# Altium schematic sheet audio_ldo.SchDoc
size 420 x 297 mm; Organization: Altium Limited; Address1: L3, 12a Rodborough Rd; Address2: Frenchs Forest; Address3: NSW; Address4: Australia 2086
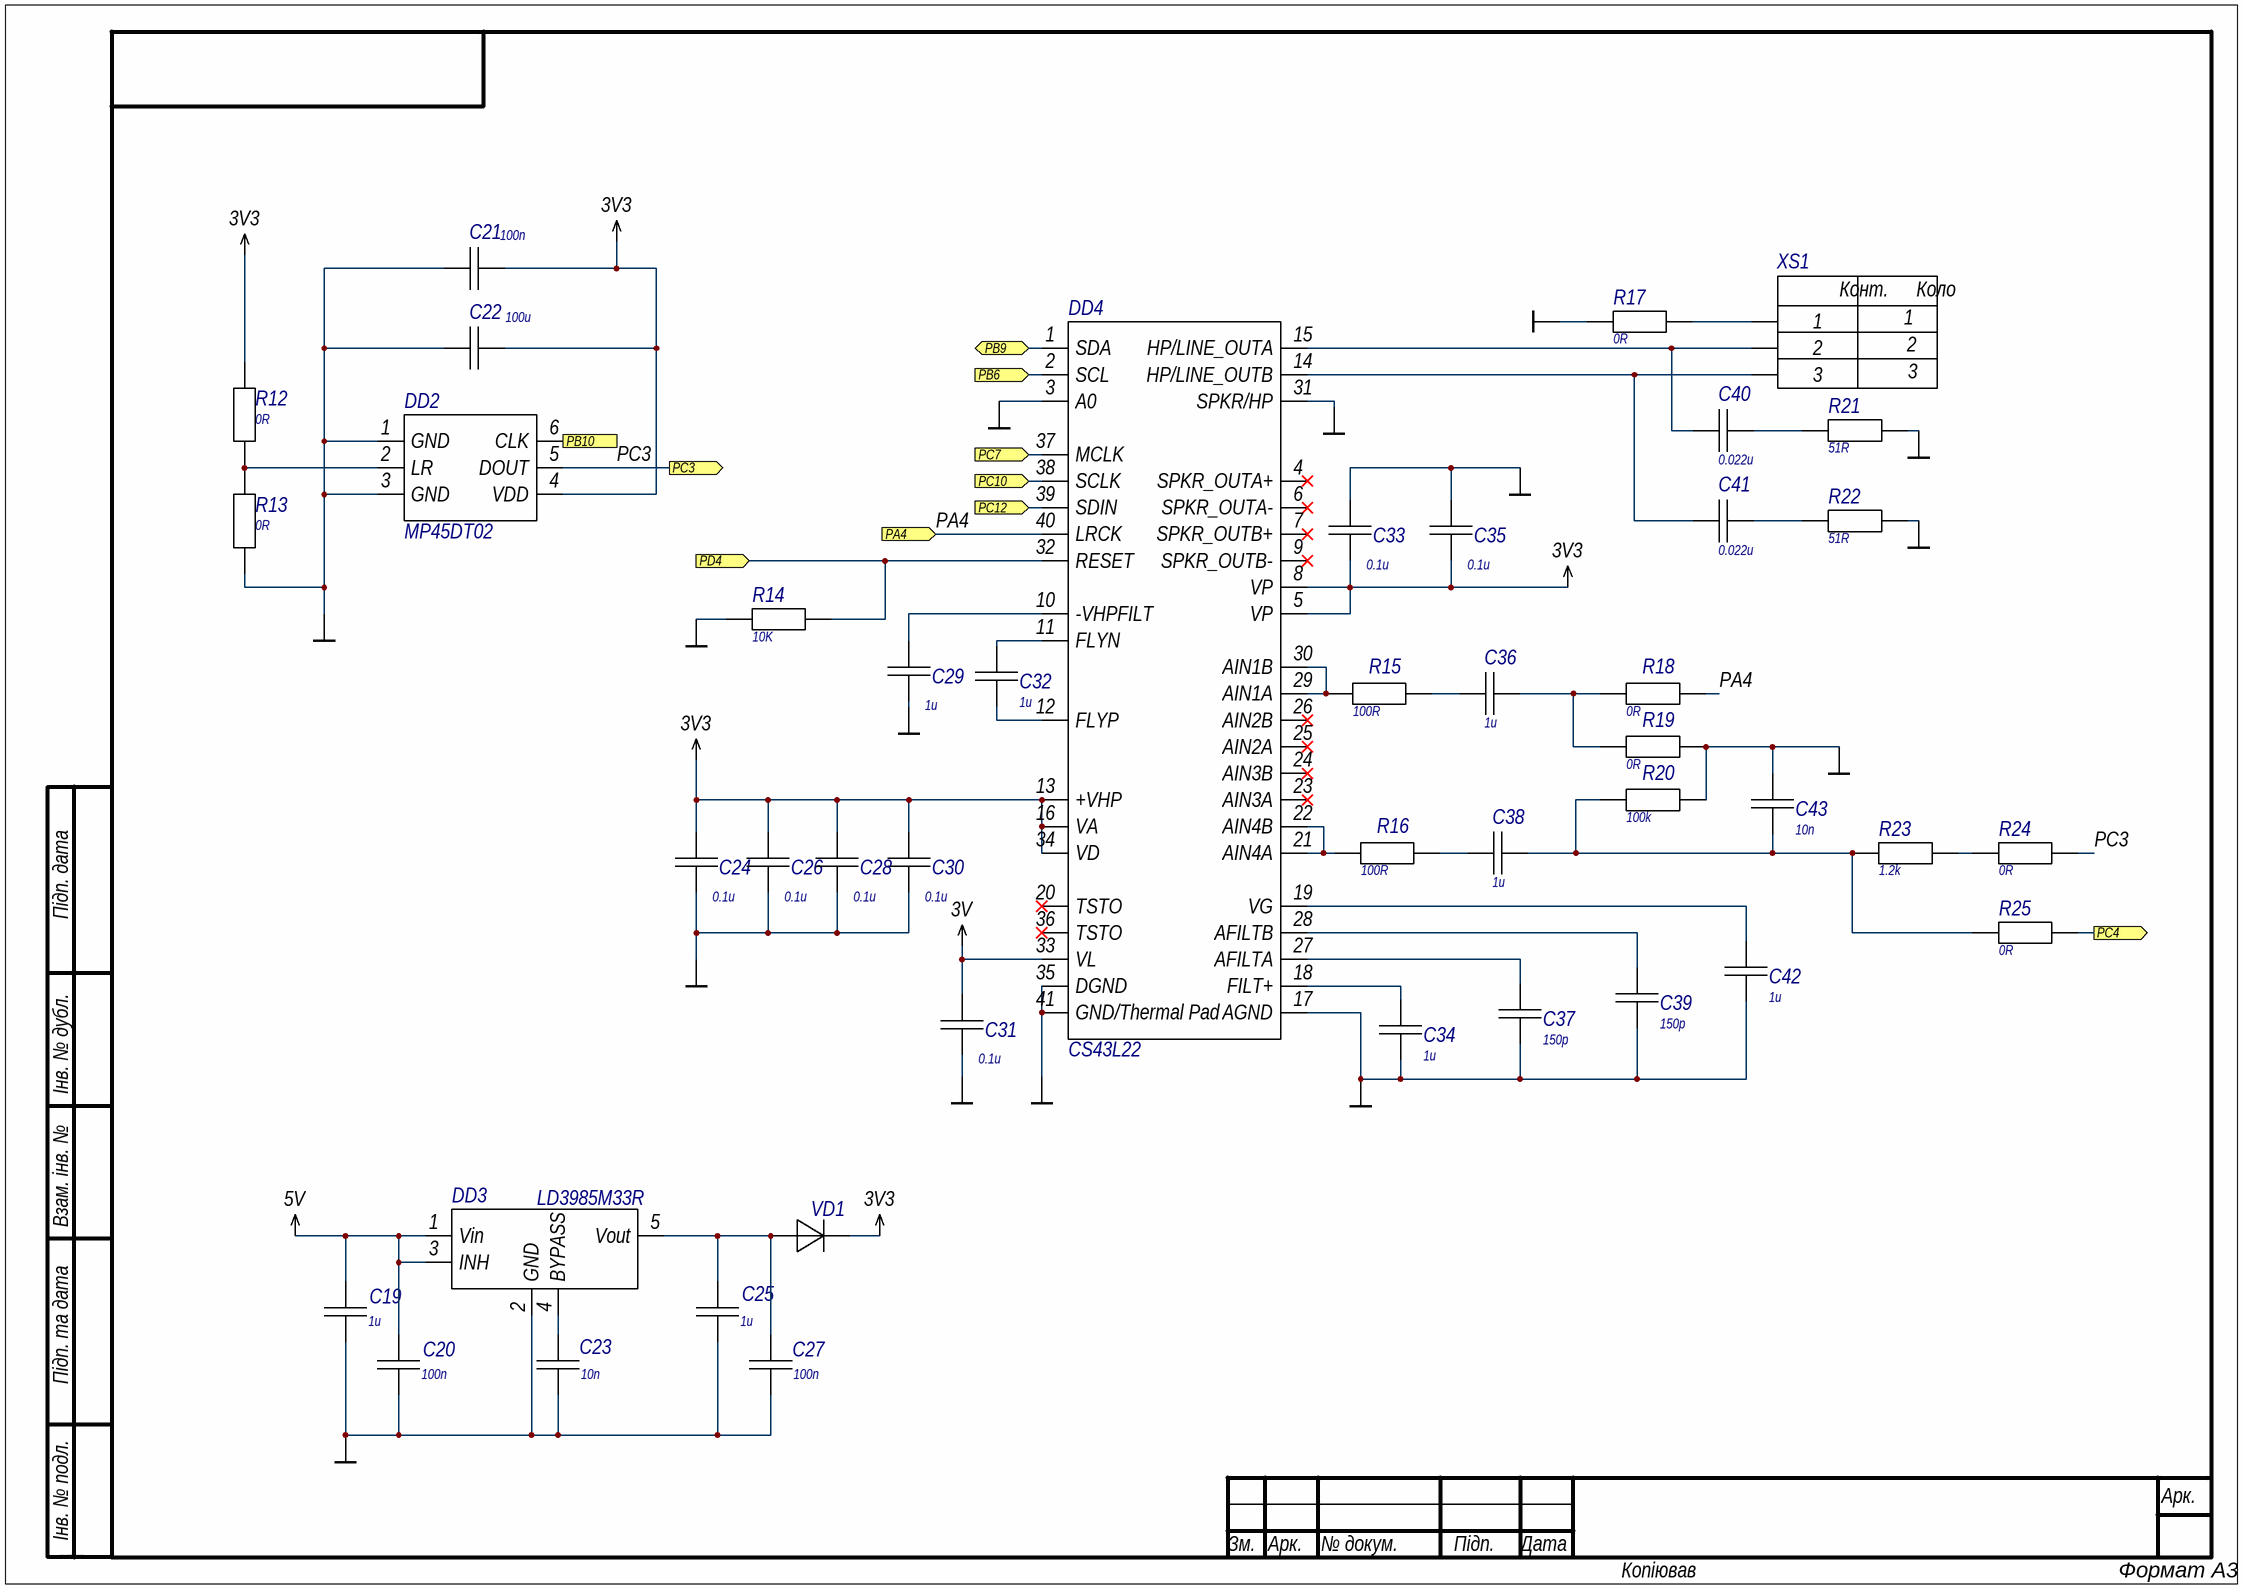
[diagram p0: audio_ldo.SchDoc]

## Parts
C19  value 1u  [C_0603]
C20  value 100n  [C_0603]
C21  value 100n  [C_0603]
C22  value 100u  [C_0603]
C23  value 10n  [C_0603]
C24  value 0.1u  [C_0603]
C25  value 1u  [C_0603]
C26  value 0.1u  [C_0603]
C27  value 100n  [C_0603]
C28  value 0.1u  [C_0603]
C29  value 1u  [C_0603]
C30  value 0.1u  [C_0603]
C31  value 0.1u  [C_0603]
C32  value 1u  [C_0603]
C33  value 0.1u  [C_0603]
C34  value 1u  [C_0603]
C35  value 0.1u  [C_0603]
C36  value 1u  [C_0603]
C37  value 150p  [C_0603]
C38  value 1u  [C_0603]
C39  value 150p  [C_0603]
C40  value 0.022u  [C_0603]
C41  value 0.022u  [C_0603]
C42  value 1u  [C_0603]
C43  value 10n  [C_0603]
DD2  (no value)  [MP45DT02]
DD3  (no value)  [LD3985M33R]
DD4  (no value)  [CS43L22]
R12  value 0R  [R0_0603]  (hidden comment: 0603 В 0R 1% Keystone Electronics)
R13  value 0R  [R0_0603]  (hidden comment: 0603 В 0R 1% Keystone Electronics)
R14  value 10K  [R0_0603]  (hidden comment: 0603 В 10K 1% Keystone Electronics)
R15  value 100R  [R0_0603]  (hidden comment: 0603 В 100R 1% Keystone Electronics)
R16  value 100R  [R0_0603]  (hidden comment: 0603 В 100R 1% Keystone Electronics)
R17  value 0R  [R0_0603]  (hidden comment: 0603 В 0R 1% Keystone Electronics)
R18  value 0R  [R0_0603]  (hidden comment: 0603 В 0R 1% Keystone Electronics)
R19  value 0R  [R0_0603]  (hidden comment: 0603 В 0R 1% Keystone Electronics)
R20  value 100k  [R0_0603]  (hidden comment: 0603 В 100k 1% Keystone Electronics)
R21  value 51R  [R0_0603]  (hidden comment: 0603 В 51R 1% Keystone Electronics)
R22  value 51R  [R0_0603]  (hidden comment: 0603 В 51R 1% Keystone Electronics)
R23  value 1.2k  [R0_0603]  (hidden comment: 0603 В 1.2k 1% Keystone Electronics)
R24  value 0R  [R0_0603]  (hidden comment: 0603 В 0R 1% Keystone Electronics)
R25  value 0R  [R0_0603]  (hidden comment: 0603 В 0R 1% Keystone Electronics)
VD1  (no value)  [BAT60JFILM]
XS1  SJ1-2503A Same Sky (Formerly CUI Devices)  [XS_AUDIO]  (value not drawn)

## Ports
PA4 (in), PB6 (in), PB9 (bidir), PB10 (in), PC3 (out), PC4 (out), PC7 (in), PC10 (in), PC12 (in), PD4 (in)

## Nets
3V: C31.2 DD4.33(VL)
3V3: C21.2 C22.2 C24.2 C26.2 C28.2 C30.2 C33.1 C35.1 DD2.4(VDD) DD4.5(VP) DD4.8(VP) DD4.13(+VHP) DD4.16(VA) DD4.34(VD) R12.1 VD1.2
5V: C19.2 C20.2 DD3.1(Vin) DD3.3(INH)
GND: C19.1 C20.1 C21.1 C22.1 C23.1 C24.1 C25.1 C26.1 C27.1 C28.1 C29.1 C30.1 C31.1 C33.2 C34.2 C35.2 C37.2 C39.1 C42.2 C43.1 DD2.1(GND) DD2.3(GND) DD3.2(GND) DD4.3(A0) DD4.17(AGND) DD4.31(SPKR/HP) DD4.35(DGND) DD4.41(GND/Thermal_Pad) R13.2 R14.2 R17.1 R19.2 R20.2 R21.2 R22.2
PA4: DD4.40(LRCK) R18.2 ; port PA4
PB6: DD4.2(SCL) ; port PB6
PB9: DD4.1(SDA) ; port PB9
PB10: DD2.6(CLK) ; port PB10
PC3: DD2.5(DOUT) R24.2 ; port PC3
PC4: R25.2 ; port PC4
PC7: DD4.37(MCLK) ; port PC7
PC10: DD4.38(SCLK) ; port PC10
PC12: DD4.39(SDIN) ; port PC12
PD4: DD4.32(RESET) R14.1 ; port PD4
NetC23_2: C23.2 DD3.4(BYPASS)
NetC25_2: C25.2 C27.2 DD3.5(Vout) VD1.1
NetC29_2: C29.2 DD4.10(-VHPFILT)
NetC32_1: C32.1 DD4.11(FLYN)
NetC32_2: C32.2 DD4.12(FLYP)
NetC34_1: C34.1 DD4.18(FILT+)
NetC36_1: C36.1 R18.1 R19.1
NetC36_2: C36.2 R15.2
NetC37_1: C37.1 DD4.27(AFILTA)
NetC38_1: C38.1 C43.2 R20.1 R23.1 R25.1
NetC38_2: C38.2 R16.2
NetC39_2: C39.2 DD4.28(AFILTB)
NetC40_1: C40.1 DD4.15(HP/LINE_OUTA) XS1.2
NetC40_2: C40.2 R21.1
NetC41_1: C41.1 DD4.14(HP/LINE_OUTB) XS1.3
NetC41_2: C41.2 R22.1
NetC42_1: C42.1 DD4.19(VG)
NetDD2_2: DD2.2(LR) R12.2 R13.1
NetDD4_21: DD4.21(AIN4A) DD4.22(AIN4B) R16.1
NetDD4_29: DD4.29(AIN1A) DD4.30(AIN1B) R15.1
NetR17_2: R17.2 XS1.1
NetR23_2: R23.2 R24.1

Not connected (* = marked no-connect by the designer): DD4 4(SPKR_OUTA+)* 6(SPKR_OUTA-)* 7(SPKR_OUTB+)* 9(SPKR_OUTB-)* 20(TSTO)* 23(AIN3A)* 24(AIN3B)* 25(AIN2A)* 26(AIN2B)* 36(TSTO)*

## Notes on the sheet
- Підп. дата
- Інв. № дубл.
- Взам. інв. №
- Підп. та дата
- Інв. № подл.
- Зм.
- Арк.
- № докум.
- Підп.
- Дата
- ALTIUM GOSTBOM2.0 KEV
- Копіював
- Формат А3
- (in symbol JACK) Конт.; Коло

## Library data of the parts
C19-C43 = C_0603: Manufacturer: TDK Corporation; Temp_Coef: X7R; Voltage: 50 В; Tolerance: 10%; Package: 0603
DD2 = MP45DT02: Manufacturer: STMicroelectronics; Name: MP45DT02
DD3 = LD3985M33R: Manufacturer: STMicroelectronics; Name: LD3985M33R
DD4 = CS43L22: Manufaturer: Cirrus Logic Inc.; Name: CS43L22
R12-R25 = R_0603: Package: 0603; Power: В; Tolerance: 1%; Manufacturer: Keystone Electronics
VD1 = BAT60JFILM: Manufacturer: STMicroelectronics; Name: BAT60JFILM
XS1 = JACK: Name: SJ1-2503A; Manufacturer: Same Sky (Formerly CUI Devices)